# Altium schematic sheet mcu.SchDoc
size 431 x 279 mm
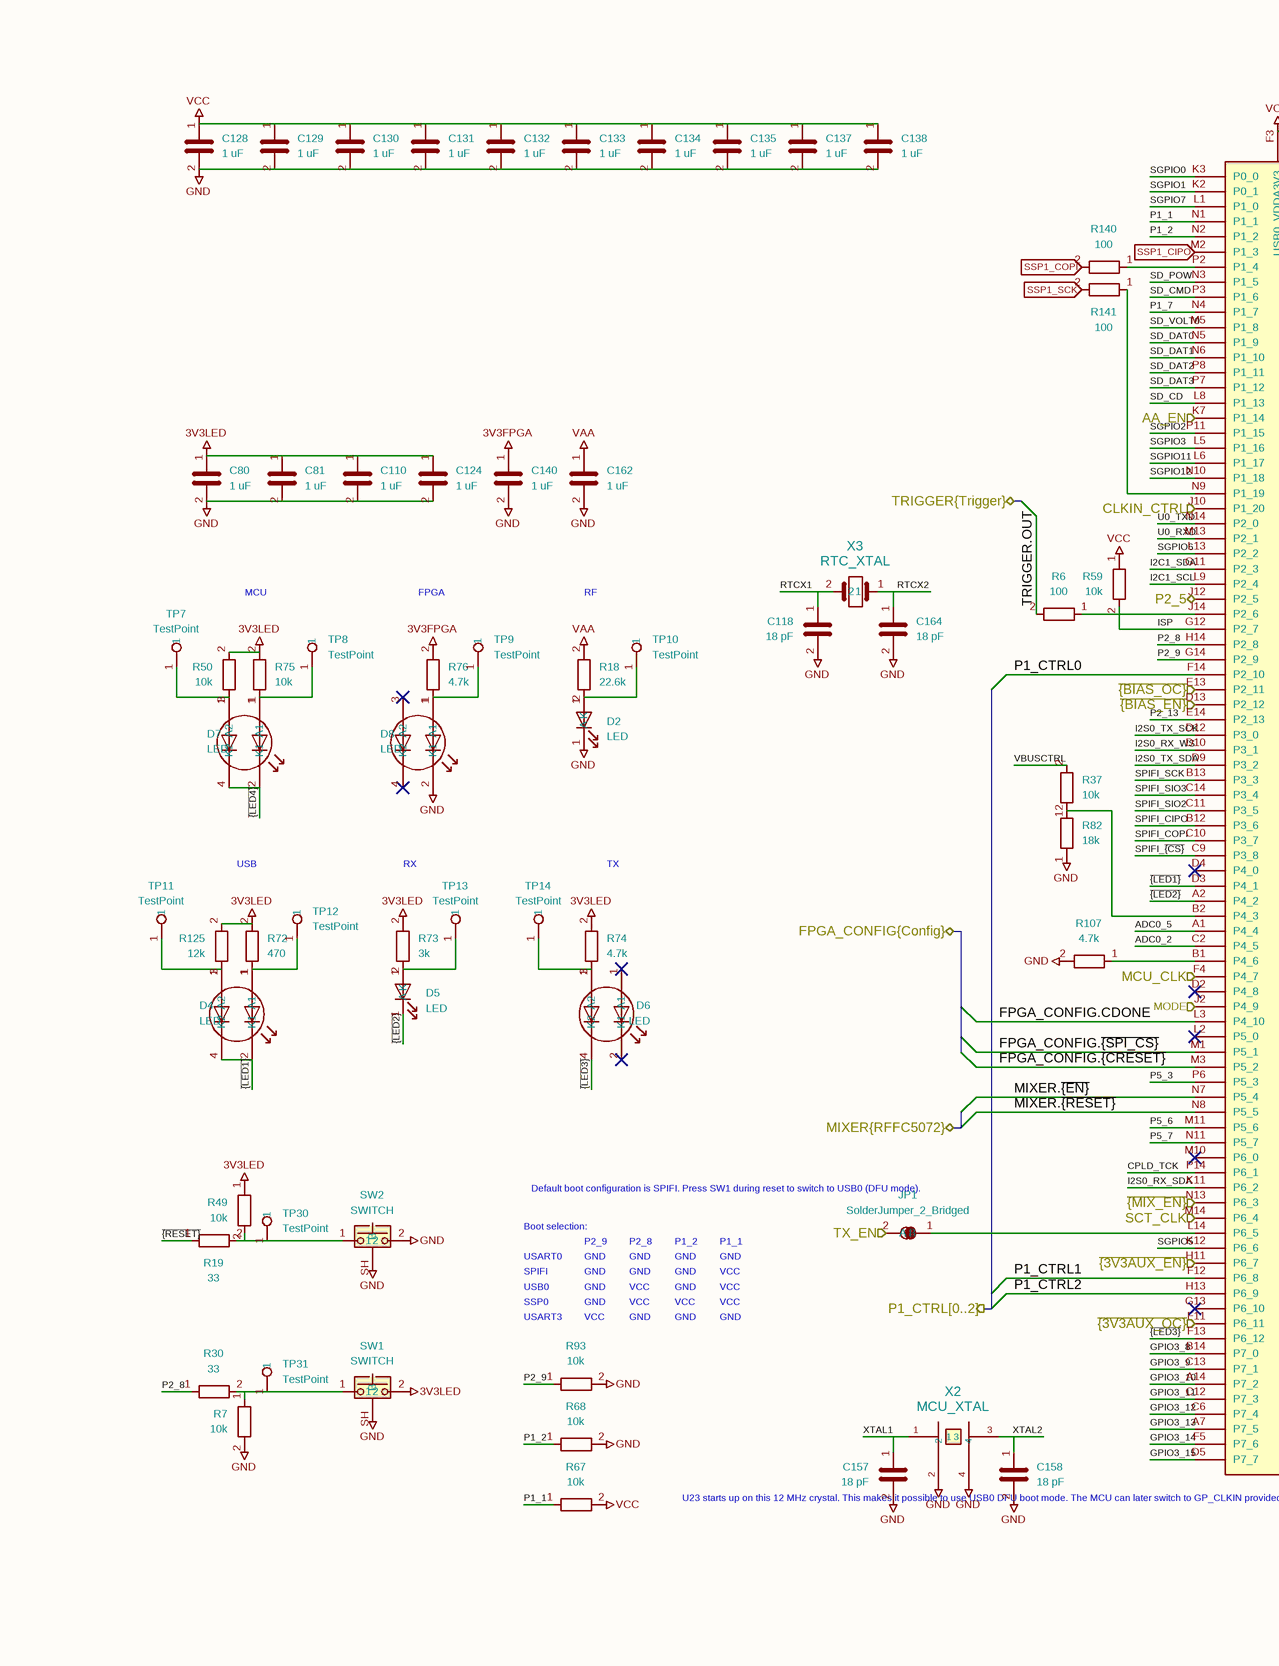
[diagram p0: mcu.SchDoc, left]
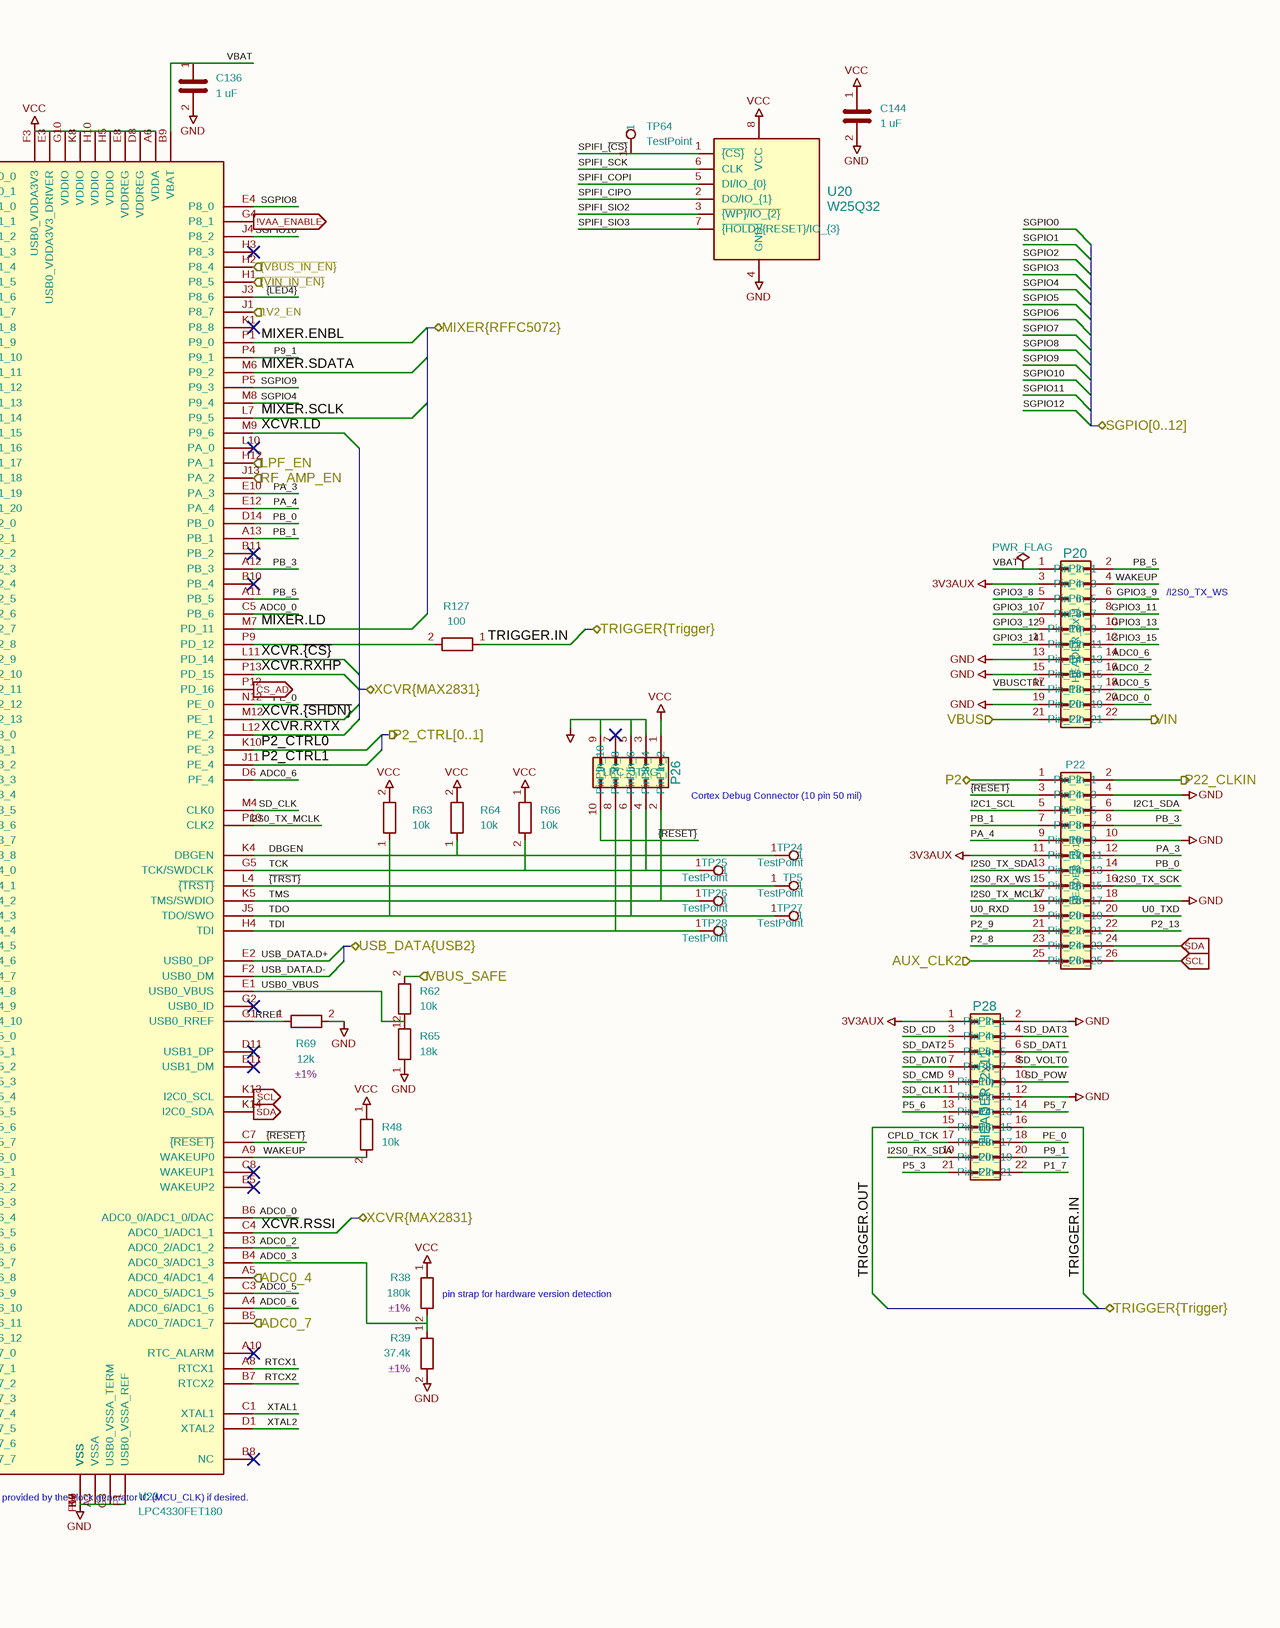
[diagram p1: mcu.SchDoc, right]

## Parts
#FLG07  PWR_FLAG  (graphical)
C80  1 uF  [C_0402_1005Metric]
C81  1 uF  [C_0402_1005Metric]
C110  1 uF  [C_0402_1005Metric]
C118  18 pF  [C_0402_1005Metric]
C124  1 uF  [C_0402_1005Metric]
C128  1 uF  [C_0402_1005Metric]
C129  1 uF  [C_0402_1005Metric]
C130  1 uF  [C_0402_1005Metric]
C131  1 uF  [C_0402_1005Metric]
C132  1 uF  [C_0402_1005Metric]
C133  1 uF  [C_0402_1005Metric]
C134  1 uF  [C_0402_1005Metric]
C135  1 uF  [C_0402_1005Metric]
C136  1 uF  [C_0402_1005Metric]
C137  1 uF  [C_0402_1005Metric]
C138  1 uF  [C_0402_1005Metric]
C140  1 uF  [C_0402_1005Metric]
C144  1 uF  [C_0402_1005Metric]
C157  18 pF  [C_0402_1005Metric]
C158  18 pF  [C_0402_1005Metric]
C162  1 uF  [C_0402_1005Metric]
C164  18 pF  [C_0402_1005Metric]
D2  LED  [LED_Single_Xinglight_XL-3210_Horizontal]
D4  LED  [LED_Dual_Xinglight_XL-3210_Horizontal]
D5  LED  [LED_Single_Xinglight_XL-3210_Horizontal]
D6  LED  [LED_Dual_Xinglight_XL-3210_Horizontal]
D7  LED  [LED_Dual_Xinglight_XL-3210_Horizontal]
D8  LED  [LED_Dual_Xinglight_XL-3210_Horizontal]
JP1  SolderJumper_2_Bridged  [SolderJumper-2_P1.3mm_Bridged_RoundedPad1.0x1.5mm]
P20  HEADER_2x11  [PinSocket_2x11_P2.54mm_Vertical_Flipped]
P22  HEADER_2x13  [PinSocket_2x13_P2.54mm_Vertical_Flipped]
P26  LPC_JTAG  [PinHeader_2x05_P1.27mm_Vertical]
P28  HEADER_2x11  [PinSocket_2x11_P2.54mm_Vertical_Flipped]
R6  100  [R_0201_0603Metric]
R7  10k  [R_0402_1005Metric]
R18  22.6k  [R_0201_0603Metric]
R19  33  [R_0201_0603Metric]
R30  33  [R_0201_0603Metric]
R37  10k  [R_0402_1005Metric]
R38  Tolerance: ±1%  [R_0402_1005Metric]  (hidden comment: 180k)
R39  Tolerance: ±1%  [R_0402_1005Metric]  (hidden comment: 37.4k)
R48  10k  [R_0402_1005Metric]
R49  10k  [R_0402_1005Metric]
R50  10k  [R_0402_1005Metric]
R59  10k  [R_0402_1005Metric]
R62  10k  [R_0402_1005Metric]
R63  10k  [R_0402_1005Metric]
R64  10k  [R_0402_1005Metric]
R65  18k  [R_0402_1005Metric]
R66  10k  [R_0402_1005Metric]
R67  10k  [R_0402_1005Metric]
R68  10k  [R_0402_1005Metric]
R69  Tolerance: ±1%  [R_0201_0603Metric]  (hidden comment: 12k)
R72  470  [R_0201_0603Metric]
R73  3k  [R_0402_1005Metric]
R74  4.7k  [R_0201_0603Metric]
R75  10k  [R_0402_1005Metric]
R76  4.7k  [R_0201_0603Metric]
R82  18k  [R_0402_1005Metric]
R93  10k  [R_0402_1005Metric]
R107  4.7k  [R_0201_0603Metric]
R125  12k  [R_0201_0603Metric]
R127  100  [R_0201_0603Metric]
R140  100  [R_0201_0603Metric]
R141  100  [R_0201_0603Metric]
SW1  SWITCH  [SW_Tactile_SPST_Angled_PTS645Vx58-2LFS]
SW2  SWITCH  [SW_Tactile_SPST_Angled_PTS645Vx58-2LFS]
TP5  TestPoint  [TestPoint_Pad_D1.0mm]
TP7  TestPoint  [TestPoint_Pad_D1.0mm]
TP8  TestPoint  [TestPoint_Pad_D1.0mm]
TP9  TestPoint  [TestPoint_Pad_D1.0mm]
TP10  TestPoint  [TestPoint_Pad_D1.0mm]
TP11  TestPoint  [TestPoint_Pad_D1.0mm]
TP12  TestPoint  [TestPoint_Pad_D1.0mm]
TP13  TestPoint  [TestPoint_Pad_D1.0mm]
TP14  TestPoint  [TestPoint_Pad_D1.0mm]
TP24  TestPoint  [TestPoint_Pad_D1.0mm]
TP25  TestPoint  [TestPoint_Pad_D1.0mm]
TP26  TestPoint  [TestPoint_Pad_D1.0mm]
TP27  TestPoint  [TestPoint_Pad_D1.0mm]
TP28  TestPoint  [TestPoint_Pad_D1.0mm]
TP30  TestPoint  [TestPoint_Pad_D1.0mm]
TP31  TestPoint  [TestPoint_Pad_D1.0mm]
TP64  TestPoint  [TestPoint_Pad_D1.0mm]
U20  W25Q32  [SOIC-8_5.3x5.3mm_P1.27mm]
U23  LPC4330FET180  [TFBGA-180_12x12mm_Layout14x14_P0.8mm]
X2  MCU_XTAL  [Crystal_SMD_3225-4Pin_3.2x2.5mm]
X3  RTC_XTAL  [Crystal_SMD_3215-2Pin_3.2x1.5mm]

## Ports
1V2_EN (out), !VAA_ENABLE (in), AA_EN (out), ADC0_4 (in), ADC0_7 (in), AUX_CLK2 (in), CLKIN_CTRL (out), CS_AD (in), FPGA_CONFIG{Config} (bidir), LPF_EN (out), MCU_CLK (in), MIXER{RFFC5072} (bidir), MODE (out), P1_CTRL[0..2] (out), P2 (bidir), P2_5 (bidir), P2_CTRL[0..1] (out), P22_CLKIN (out), RF_AMP_EN (out), SCL (in), SCT_CLK (in), SDA (in), SGPIO[0..12] (bidir), SSP1_CIPO (in), SSP1_COPI (in), SSP1_SCK (in), TRIGGER{Trigger} (bidir), TX_EN (out), USB_DATA{USB2} (bidir), VBUS (in), VBUS_SAFE (in), VIN (out), XCVR{MAX2831} (bidir), ~{{3V3AUX_EN}} (out), ~{{3V3AUX_OC}} (in), ~{{BIAS_EN}} (out), ~{{BIAS_OC}} (in), ~{{MIX_EN}} (out), ~{{VBUS_IN_EN}} (out), ~{{VIN_IN_EN}} (out)

## Nets
3V3AUX: P20.3(Pin_3) P22.11(Pin_11) P28.1(Pin_1)
3V3FPGA: C140.1 R76.2
3V3LED: C80.1 C81.1 C110.1 C124.1 R49.1 R50.2 R72.2 R73.2 R74.2 R75.2 R125.2 SW1.2
GND: C80.2 C81.2 C110.2 C118.2 C124.2 C128.2 C129.2 C130.2 C131.2 C132.2 C133.2 C134.2 C135.2 C136.2 C137.2 C138.2 C140.2 C144.2 C157.2 C158.2 C162.2 C164.2 D2.1(K) D8.2(K1) P20.13(Pin_13) P20.15(Pin_15) P20.19(Pin_19) P22.4(Pin_4) P22.10(Pin_10) P22.18(Pin_18) P26.3(Pin_3) P26.5(Pin_5) P26.9(Pin_9) P28.2(Pin_2) P28.12(Pin_12) R7.2 R39.2 R65.1 R68.2 R69.2 R82.1 R93.2 R107.2 SW1.SH(B) SW2.2 SW2.SH(B) U20.4(GND) U23.A3(VSSA) U23.D7(VSS) U23.E6(VSS) U23.E7(VSS) U23.E9(VSS) U23.F1(USB0_VSSA_REF) U23.F10(VSS) U23.G3(USB0_VSSA_TERM) U23.K6(VSS) U23.K9(VSS) X2.2 X2.4
VAA: C162.1 R18.2
VCC: C128.1 C129.1 C130.1 C131.1 C132.1 C133.1 C134.1 C135.1 C137.1 C138.1 C144.1 P26.1(Pin_1) R38.1 R48.1 R59.1 R63.2 R64.2 R66.1 R67.2 U20.8(VCC) U23.A6(VDDA) U23.D8(VDDREG) U23.E3(USB0_VDDA3V3_DRIVER) U23.E8(VDDREG) U23.F3(USB0_VDDA3V3) U23.G10(VDDIO) U23.H5(VDDIO) U23.H10(VDDIO) U23.K8(VDDIO)
1V2_EN: U23.J1(P8_7) ; port 1V2_EN
!VAA_ENABLE: U23.G4(P8_1) ; port !VAA_ENABLE
AA_EN: U23.K7(P1_14) ; port AA_EN
ADC0_0: P20.20(Pin_20) U23.B6(ADC0_0/ADC1_0/DAC) U23.C5(PB_6)
ADC0_2: P20.16(Pin_16) U23.B3(ADC0_2/ADC1_2) U23.C2(P4_5)
ADC0_3: R38.2 R39.1 U23.B4(ADC0_3/ADC1_3)
ADC0_4: U23.A5(ADC0_4/ADC1_4) ; port ADC0_4
ADC0_5: P20.18(Pin_18) U23.A1(P4_4) U23.C3(ADC0_5/ADC1_5)
ADC0_6: P20.14(Pin_14) U23.A4(ADC0_6/ADC1_6) U23.D6(PF_4)
ADC0_7: U23.B5(ADC0_7/ADC1_7) ; port ADC0_7
AUX_CLK2: P22.25(Pin_25) ; port AUX_CLK2
CLKIN_CTRL: U23.J10(P1_20) ; port CLKIN_CTRL
CPLD_TCK: P28.17(Pin_17) U23.P14(P6_1)
CS_AD: U23.P12(PD_16) ; port CS_AD
DBGEN: R64.1 TP24.1 U23.K4(DBGEN)
FPGA_CONFIG.CDONE: U23.L3(P4_10)
FPGA_CONFIG.~{{CRESET}}: U23.M3(P5_2)
FPGA_CONFIG.~{{SPI_CS}}: U23.M1(P5_1)
GPIO3_8: P20.5(Pin_5) U23.B14(P7_0)
GPIO3_9: P20.6(Pin_6) U23.C13(P7_1)
GPIO3_10: P20.7(Pin_7) U23.A14(P7_2)
GPIO3_11: P20.8(Pin_8) U23.C12(P7_3)
GPIO3_12: P20.9(Pin_9) U23.C6(P7_4)
GPIO3_13: P20.10(Pin_10) U23.A7(P7_5)
GPIO3_14: P20.11(Pin_11) U23.F5(P7_6)
GPIO3_15: P20.12(Pin_12) U23.D5(P7_7)
I2C1_SCL: P22.5(Pin_5) U23.L9(P2_4)
I2C1_SDA: P22.6(Pin_6) U23.G11(P2_3)
I2S0_RX_SDA: P28.19(Pin_19) U23.K11(P6_2)
I2S0_RX_WS: P22.15(Pin_15) U23.D10(P3_1)
I2S0_TX_MCLK: P22.17(Pin_17) U23.P10(CLK2)
I2S0_TX_SCK: P22.16(Pin_16) U23.D12(P3_0)
I2S0_TX_SDA: P22.13(Pin_13) U23.D9(P3_2)
ISP: R59.2 U23.G12(P2_7)
LPF_EN: U23.H12(PA_1) ; port LPF_EN
MCU_CLK: U23.F4(P4_7) ; port MCU_CLK
MIXER.ENBL: U23.P1(P9_0)
MIXER.LD: U23.M7(PD_11)
MIXER.SCLK: U23.L7(P9_5)
MIXER.SDATA: U23.M6(P9_2)
MIXER.~{{EN}}: U23.N7(P5_4)
MIXER.~{{RESET}}: U23.N8(P5_5)
MODE: U23.J2(P4_9) ; port MODE
P1_1: R67.1 U23.N1(P1_1)
P1_2: R68.1 U23.N2(P1_2)
P1_7: P28.22(Pin_22) U23.N4(P1_7)
P1_CTRL0: U23.F14(P2_10)
P1_CTRL1: U23.F12(P6_8)
P1_CTRL2: U23.H13(P6_9)
P2: P22.1(Pin_1) ; port P2
P2_5: U23.J12(P2_5) ; port P2_5
P2_8: P22.23(Pin_23) R30.1 U23.H14(P2_8)
P2_9: P22.21(Pin_21) R93.1 U23.G14(P2_9)
P2_13: P22.22(Pin_22) U23.E14(P2_13)
P2_CTRL0: U23.K10(PE_3)
P2_CTRL1: U23.J11(PE_4)
P5_3: P28.21(Pin_21) U23.P6(P5_3)
P5_6: P28.13(Pin_13) U23.M11(P5_6)
P5_7: P28.14(Pin_14) U23.N11(P5_7)
P9_1: P28.20(Pin_20) U23.P4(P9_1)
P22_CLKIN: P22.2(Pin_2) ; port P22_CLKIN
PA_3: P22.12(Pin_12) U23.E10(PA_3)
PA_4: P22.9(Pin_9) U23.E12(PA_4)
PB_0: P22.14(Pin_14) U23.D14(PB_0)
PB_1: P22.7(Pin_7) U23.A13(PB_1)
PB_3: P22.8(Pin_8) U23.A12(PB_3)
PB_5: P20.2(Pin_2) U23.A11(PB_5)
PE_0: P28.18(Pin_18) U23.N12(PE_0)
RF_AMP_EN: U23.J13(PA_2) ; port RF_AMP_EN
RREF: R69.1 U23.G1(USB0_RREF)
RTCX1: C118.1 U23.A8(RTCX1) X3.2
RTCX2: C164.1 U23.B7(RTCX2) X3.1
SCL: P22.26(Pin_26) U23.K13(I2C0_SCL) ; port SCL
SCT_CLK: U23.M14(P6_4) ; port SCT_CLK
SD_CD: P28.3(Pin_3) U23.L8(P1_13)
SD_CLK: P28.11(Pin_11) U23.M4(CLK0)
SD_CMD: P28.9(Pin_9) U23.P3(P1_6)
SD_DAT0: P28.7(Pin_7) U23.N5(P1_9)
SD_DAT1: P28.6(Pin_6) U23.N6(P1_10)
SD_DAT2: P28.5(Pin_5) U23.P8(P1_11)
SD_DAT3: P28.4(Pin_4) U23.P7(P1_12)
SD_POW: P28.10(Pin_10) U23.N3(P1_5)
SD_VOLT0: P28.8(Pin_8) U23.M5(P1_8)
SDA: P22.24(Pin_24) U23.K14(I2C0_SDA) ; port SDA
SGPIO0: U23.K3(P0_0)
SGPIO1: U23.K2(P0_1)
SGPIO2: U23.P11(P1_15)
SGPIO3: U23.L5(P1_16)
SGPIO4: U23.M8(P9_4)
SGPIO5: U23.K12(P6_6)
SGPIO6: U23.L13(P2_2)
SGPIO7: U23.L1(P1_0)
SGPIO8: U23.E4(P8_0)
SGPIO9: U23.P5(P9_3)
SGPIO10: U23.J4(P8_2)
SGPIO11: U23.L6(P1_17)
SGPIO12: U23.N10(P1_18)
SPIFI_CIPO: U20.2(DO/IO_{1}) U23.B12(P3_6)
SPIFI_COPI: U20.5(DI/IO_{0}) U23.C10(P3_7)
SPIFI_SCK: U20.6(CLK) U23.B13(P3_3)
SPIFI_SIO2: U20.3(~{{WP}/IO_{2}}) U23.C11(P3_5)
SPIFI_SIO3: U20.7(~{{HOLD}/}{RESET}/IO_{3}) U23.C14(P3_4)
SPIFI_~{{CS}}: TP64.1 U20.1(~{{CS}}) U23.C9(P3_8)
SSP1_CIPO: U23.M2(P1_3) ; port SSP1_CIPO
SSP1_COPI: R140.2 ; port SSP1_COPI
SSP1_SCK: R141.2 ; port SSP1_SCK
TCK: P26.4(Pin_4) R66.2 TP25.1 U23.G5(TCK/SWDCLK)
TDI: P26.8(Pin_8) TP28.1 U23.H4(TDI)
TDO: P26.6(Pin_6) R63.1 TP27.1 U23.J5(TDO/SWO)
TMS: P26.2(Pin_2) TP26.1 U23.K5(TMS/SWDIO)
TRIGGER.IN: P28.16(Pin_16) R127.1
TRIGGER.OUT: P28.15(Pin_15) R6.2
TX_EN: JP1.2(B) ; port TX_EN
U0_RXD: P22.19(Pin_19) U23.M13(P2_1)
U0_TXD: P22.20(Pin_20) U23.N14(P2_0)
USB0_VBUS: R62.1 R65.2 U23.E1(USB0_VBUS)
USB_DATA.D+: U23.E2(USB0_DP)
USB_DATA.D-: U23.F2(USB0_DM)
VBAT: #FLG07.1 C136.1 P20.1(Pin_1) U23.B9(VBAT)
VBUS: P20.21(Pin_21) ; port VBUS
VBUS_SAFE: R62.2 ; port VBUS_SAFE
VBUSCTRL: P20.17(Pin_17) R37.2
VIN: P20.22(Pin_22) ; port VIN
WAKEUP: P20.4(Pin_4) R48.2 U23.A9(WAKEUP0)
XCVR.LD: U23.M9(P9_6)
XCVR.RSSI: U23.C4(ADC0_1/ADC1_1)
XCVR.RXHP: U23.P13(PD_15)
XCVR.RXTX: U23.L12(PE_2)
XCVR.~{{CS}}: U23.L11(PD_14)
XCVR.~{{SHDN}}: U23.M12(PE_1)
XTAL1: C157.1 U23.C1(XTAL1) X2.1
XTAL2: C158.1 U23.D1(XTAL2) X2.3
~{{3V3AUX_EN}}: U23.H11(P6_7) ; port ~{{3V3AUX_EN}}
~{{3V3AUX_OC}}: U23.F11(P6_11) ; port ~{{3V3AUX_OC}}
~{{BIAS_EN}}: U23.D13(P2_12) ; port ~{{BIAS_EN}}
~{{BIAS_OC}}: U23.E13(P2_11) ; port ~{{BIAS_OC}}
~{{LED1}}: D4.2(K1) D4.4(K2) U23.D3(P4_1)
~{{LED2}}: D5.1(K) U23.A2(P4_2)
~{{LED3}}: D6.4(K2) U23.F13(P6_12)
~{{LED4}}: D7.2(K1) D7.4(K2) U23.J3(P8_6)
~{{MIX_EN}}: U23.N13(P6_3) ; port ~{{MIX_EN}}
~{{RESET}}: P22.3(Pin_3) P26.10(Pin_10) R19.1 U23.C7(~{{RESET}})
~{{TRST}}: TP5.1 U23.L4(~{{TRST}})
~{{VBUS_IN_EN}}: U23.H2(P8_4) ; port ~{{VBUS_IN_EN}}
~{{VIN_IN_EN}}: U23.H1(P8_5) ; port ~{{VIN_IN_EN}}
NetD2_2: D2.2(A) R18.1 TP10.1
NetD4_1: D4.1(A1) R72.1 TP12.1
NetD4_3: D4.3(A2) R125.1 TP11.1
NetD5_2: D5.2(A) R73.1 TP13.1
NetD6_3: D6.3(A2) R74.1 TP14.1
NetD7_1: D7.1(A1) R75.1 TP8.1
NetD7_3: D7.3(A2) R50.1 TP7.1
NetD8_1: D8.1(A1) R76.1 TP9.1
NetJP1_1: JP1.1(A) U23.L14(P6_5)
NetR6_1: R6.1 U23.J14(P2_6)
NetR7_1: R7.1 R30.2 SW1.1 TP31.1
NetR19_2: R19.2 R49.2 SW2.1 TP30.1
NetR37_1: R37.1 R82.2 U23.B2(P4_3)
NetR107_1: R107.1 U23.B1(P4_6)
NetR127_2: R127.2 U23.P9(PD_12)
NetR140_1: R140.1 U23.P2(P1_4)
NetR141_1: R141.1 U23.N9(P1_19)

Not connected (* = marked no-connect by the designer): D6 1(A1)* 2(K1)*; D8 3(A2)* 4(K2)*; P26 7(Pin_7)*; U23 A10(RTC_ALARM)* B8(NC)* B10(PB_4)* B11(PB_2)* C8(WAKEUP1)* D2(P4_8)* D4(P4_0)* D11(USB1_DP)* E5(WAKEUP2)* E11(USB1_DM)* G2(USB0_ID)* G13(P6_10)* H3(P8_3)* K1(P8_8)* L2(P5_0)* L10(PA_0)* M10(P6_0)*

## Notes on the sheet
- MCU
- FPGA
- RF
- /I2S0_TX_WS
- (near P26) Cortex Debug
  Connector
  (10 pin 50 mil)
- USB
- RX
- TX
- (near JP1) Default boot configuration is SPIFI.
  Press SW1 during reset to switch to
  USB0 (DFU mode).
- Boot selection:
- USART0
- SPIFI
- GND
- P2_9
- P2_8
- P1_2
- VCC
- P1_1
- USB0
- SSP0
- USART3
- (near R38) pin strap for hardware
  version detection
- U23 starts up on this 12 MHz
  crystal. This makes it possible
  to use USB0 DFU boot mode.
  The MCU can later switch
  to GP_CLKIN provided by the
  clock generator IC (MCU_CLK)
  if desired.
- 1
- 2
- 3
- 4
- 5
- 6
- 7
- 8
- A
- B
- C
- D
- E
- ${LICENSE}
- Title: ${TITLE}
- File: mcu.kicad_sch
- Sheet: /
- ${COPYRIGHT}
- KiCad E.D.A.  kicad (5.1.4)-1
- Size: User
- Date: ${DATE}
- Rev: ${VERSION}
- Id: 1/1

## Library data of the parts
#FLG07 = PWR_FLAG: Description: Special symbol for telling ERC where power comes from; Value: PWR_FLAG
C80 C81 C110 C124 C128-C138 C140 C144 C162 = C: Manufacturer: Samsung; Part Number: CL05A105KA5NQNC; Description: CAP CER 1UF 25V X5R 0402; Substitution: Murata GRM155R61E105KA12D; Value: 1 uF; Footprint: Capacitor_SMD:C_0402_1005Metric
C118 C157 C158 C164 = C: Manufacturer: Samsung; Part Number: CL05C180JB5NNNC; Description: CAP CER 18PF 50V 5% C0G/NP0 0402; Substitution: Murata GRM1555C1H180JA01D; Value: 18 pF; Footprint: Capacitor_SMD:C_0402_1005Metric
D2 = LED: Manufacturer: Xinglight; Part Number: XL-3210UGC; Description: LED GREEN 1204 SMD,1.5X3.2MM; Sim.Pins: 1=K 2=A; Value: LED; Footprint: praline:LED_Single_Xinglight_XL-3210_Horizontal
D4 = LED_Dual_AKAK: Manufacturer: Xinglight; Part Number: XL-3210SURSYGC; Description: LED RED,YLW-GRN 1204 SMD; Value: LED; Footprint: praline:LED_Dual_Xinglight_XL-3210_Horizontal
D5 = LED: Manufacturer: Xinglight; Part Number: XL-3210UOC; Description: LED ORANGE 1204 SMD,1.5X3.2MM; Sim.Pins: 1=K 2=A; Value: LED; Footprint: praline:LED_Single_Xinglight_XL-3210_Horizontal
D6-D8 = LED_Dual_AKAK: Manufacturer: Xinglight; Part Number: XL-3210SURUBC; Description: LED RED,BLUE 1204 SMD,1.5X3.2MM; Value: LED; Footprint: praline:LED_Dual_Xinglight_XL-3210_Horizontal
JP1 = SolderJumper_2_Bridged: Description: Solder Jumper, 2-pole, closed/bridged; Value: SolderJumper_2_Bridged; Footprint: Jumper:SolderJumper-2_P1.3mm_Bridged_RoundedPad1.0x1.5mm
P20 P28 = Conn_02x11_Odd_Even: Manufacturer: Sullins; Part Number: PPPC112LFBN-RC; Description: CONN HEADER FMAL 22PS.1" DL GOLD; Value: HEADER_2x11; Footprint: praline:PinSocket_2x11_P2.54mm_Vertical_Flipped
P22 = Conn_02x13_Odd_Even: Manufacturer: Sullins; Part Number: PPPC132LFBN-RC; Description: CONN HEADER FMAL 26PS.1" DL GOLD; Value: HEADER_2x13; Footprint: praline:PinSocket_2x13_P2.54mm_Vertical_Flipped
P26 = Conn_02x05_Odd_Even: Manufacturer: Sullins; Part Number: GRPB052VWVN-RC; Description: CONN HEADER .050" 10PS DL PCB AU; Value: LPC_JTAG; Footprint: Connector_PinHeader_1.27mm:PinHeader_2x05_P1.27mm_Vertical
R6 R127 R140 R141 = R: Manufacturer: Yageo; Part Number: RC0201JR-07100RL; Description: RES 100 OHM 5% 1/20W 0201; Substitution: any equivalent; Value: 100; Footprint: Resistor_SMD:R_0201_0603Metric
R7 R37 R48-R50 R59 R62-R64 R66-R68 R75 R93 = R: Manufacturer: Yageo; Part Number: RC0402JR-0710KL; Description: RES 10K OHM 1/16W 5% 0402 SMD; Substitution: any equivalent; Value: 10k; Footprint: Resistor_SMD:R_0402_1005Metric
R18 = R: Manufacturer: Yageo; Part Number: RC0201FR-0722K6L; Description: RES 22.6K OHM 1% 1/20W 0201; Substitution: any equivalent; Value: 22.6k; Footprint: Resistor_SMD:R_0201_0603Metric
R19 R30 = R: Manufacturer: Yageo; Part Number: RC0201JR-0733RL; Description: RES 33 OHM 5% 1/20W 0201; Substitution: any equivalent; Value: 33; Footprint: Resistor_SMD:R_0201_0603Metric
R38 = R: Manufacturer: Yageo; Part Number: RC0402FR-07180KL; Description: RES 180K OHM 1% 1/16W 0402; Substitution: any equivalent; Value: 180k; Footprint: Resistor_SMD:R_0402_1005Metric
R39 = R: Manufacturer: Yageo; Part Number: RC0402FR-0737K4L; Description: RES 37.4K OHM 1% 1/16W 0402; Substitution: any equivalent; Value: 37.4k; Footprint: Resistor_SMD:R_0402_1005Metric
R65 R82 = R: Manufacturer: Yageo; Part Number: RC0402JR-0718KL; Description: RES SMD 18K OHM 5% 1/16W 0402; Substitution: any equivalent; Value: 18k; Footprint: Resistor_SMD:R_0402_1005Metric
R69 R125 = R: Manufacturer: Yageo; Part Number: RC0201FR-0712KL; Description: RES 12K OHM 1% 1/20W 0201; Substitution: any equivalent; Value: 12k; Footprint: Resistor_SMD:R_0201_0603Metric
R72 = R: Manufacturer: Yageo; Part Number: RC0201JR-07470RL; Description: RES 470 OHM 5% 1/20W 0201; Substitution: any equivalent; Value: 470; Footprint: Resistor_SMD:R_0201_0603Metric
R73 = R: Manufacturer: Yageo; Part Number: RC0402JR-073KL; Description: RES 3K OHM 5% 1/16W 0402; Substitution: any equivalent; Value: 3k; Footprint: Resistor_SMD:R_0402_1005Metric
R74 R76 R107 = R: Manufacturer: Yageo; Part Number: RC0201FR-074K7L; Description: RES 4.7K OHM 1% 1/20W 0201; Substitution: any equivalent; Value: 4.7k; Footprint: Resistor_SMD:R_0201_0603Metric
SW1 SW2 = SW_Push_Shielded: Manufacturer: TE Connectivity; Part Number: FSMRA3JH; Description: SWITCH TACTILE SPST-NO 0.05A 24V; Value: SWITCH; Footprint: praline:SW_Tactile_SPST_Angled_PTS645Vx58-2LFS
U20 = W25Q32JVSS: Manufacturer: Winbond; Part Number: W25Q32JVSSIQ; Description: IC FLASH 32MBIT SPI/QUAD 8SOIC; Value: W25Q32; Footprint: Package_SO:SOIC-8_5.3x5.3mm_P1.27mm
U23 = LPC43xxFET180: Manufacturer: NXP; Description: ARM Cortex-M4/M0 flashless MCU; Substitution: LPC4350FET180; Part Number: LPC4330FET180; Value: LPC4330FET180; Footprint: praline:TFBGA-180_12x12mm_Layout14x14_P0.8mm
X2 = GSG-XTAL4PIN: Manufacturer: Shenzhen SCTF Electronics; Part Number: SX3B12.000F1210F30; Description: CRYSTAL 12.000 MHZ 12PF SMD; Value: MCU_XTAL; Footprint: praline:Crystal_SMD_3225-4Pin_3.2x2.5mm
X3 = Crystal: Manufacturer: YXC; Part Number: XKXGI-SUA-32.768K; Description: CRYSTAL 32.768KHZ 12.5PF SMD; Value: RTC_XTAL; Footprint: praline:Crystal_SMD_3215-2Pin_3.2x1.5mm
TP5 TP7-TP14 TP24-TP28 TP30 TP31 TP64 = TestPoint: Value: TestPoint; Footprint: TestPoint:TestPoint_Pad_D1.0mm
  TP5: Description: test point